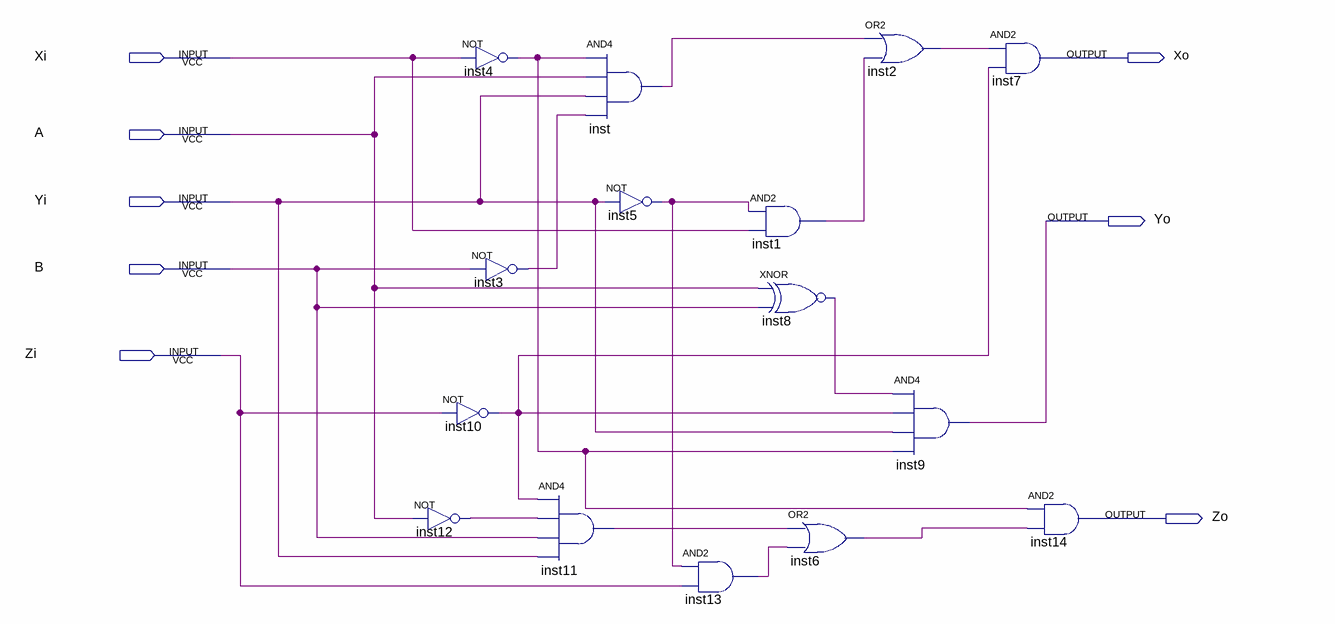
[diagram p0: schematic sheet]
// Quartus schematic onebitfullcomparator.bdf as structural Verilog: 15 symbols, 8 pins
module onebitfullcomparator (
  input  Xi,
  input  A,
  input  Yi,
  input  B,
  input  Zi,
  output Xo,
  output Yo,
  output Zo
);

  wire inst1_out, inst2_out, inst3_out, inst4_out, inst5_out, inst6_out, inst8_out, inst10_out, inst11_out,
       inst12_out, inst13_out, inst_out;

  not inst4 (inst4_out, Xi);
  not inst3 (inst3_out, B);
  not inst10 (inst10_out, Zi);
  not inst12 (inst12_out, A);
  and inst11 (inst11_out, inst10_out, inst12_out, B, Yi);
  and inst (inst_out, inst4_out, A, Yi, inst3_out);
  not inst5 (inst5_out, Yi);
  and inst13 (inst13_out, inst5_out, Zi);
  and inst1 (inst1_out, inst5_out, Xi);
  xnor inst8 (inst8_out, A, B);
  or inst6 (inst6_out, inst11_out, inst13_out);
  or inst2 (inst2_out, inst_out, inst1_out);
  and inst9 (Yo, inst8_out, inst10_out, Yi, inst4_out);
  and inst7 (Xo, inst2_out, inst10_out);
  and inst14 (Zo, inst4_out, inst6_out);
endmodule
